# Altium schematic sheet 06_MCU.SchDoc
size OrCAD B
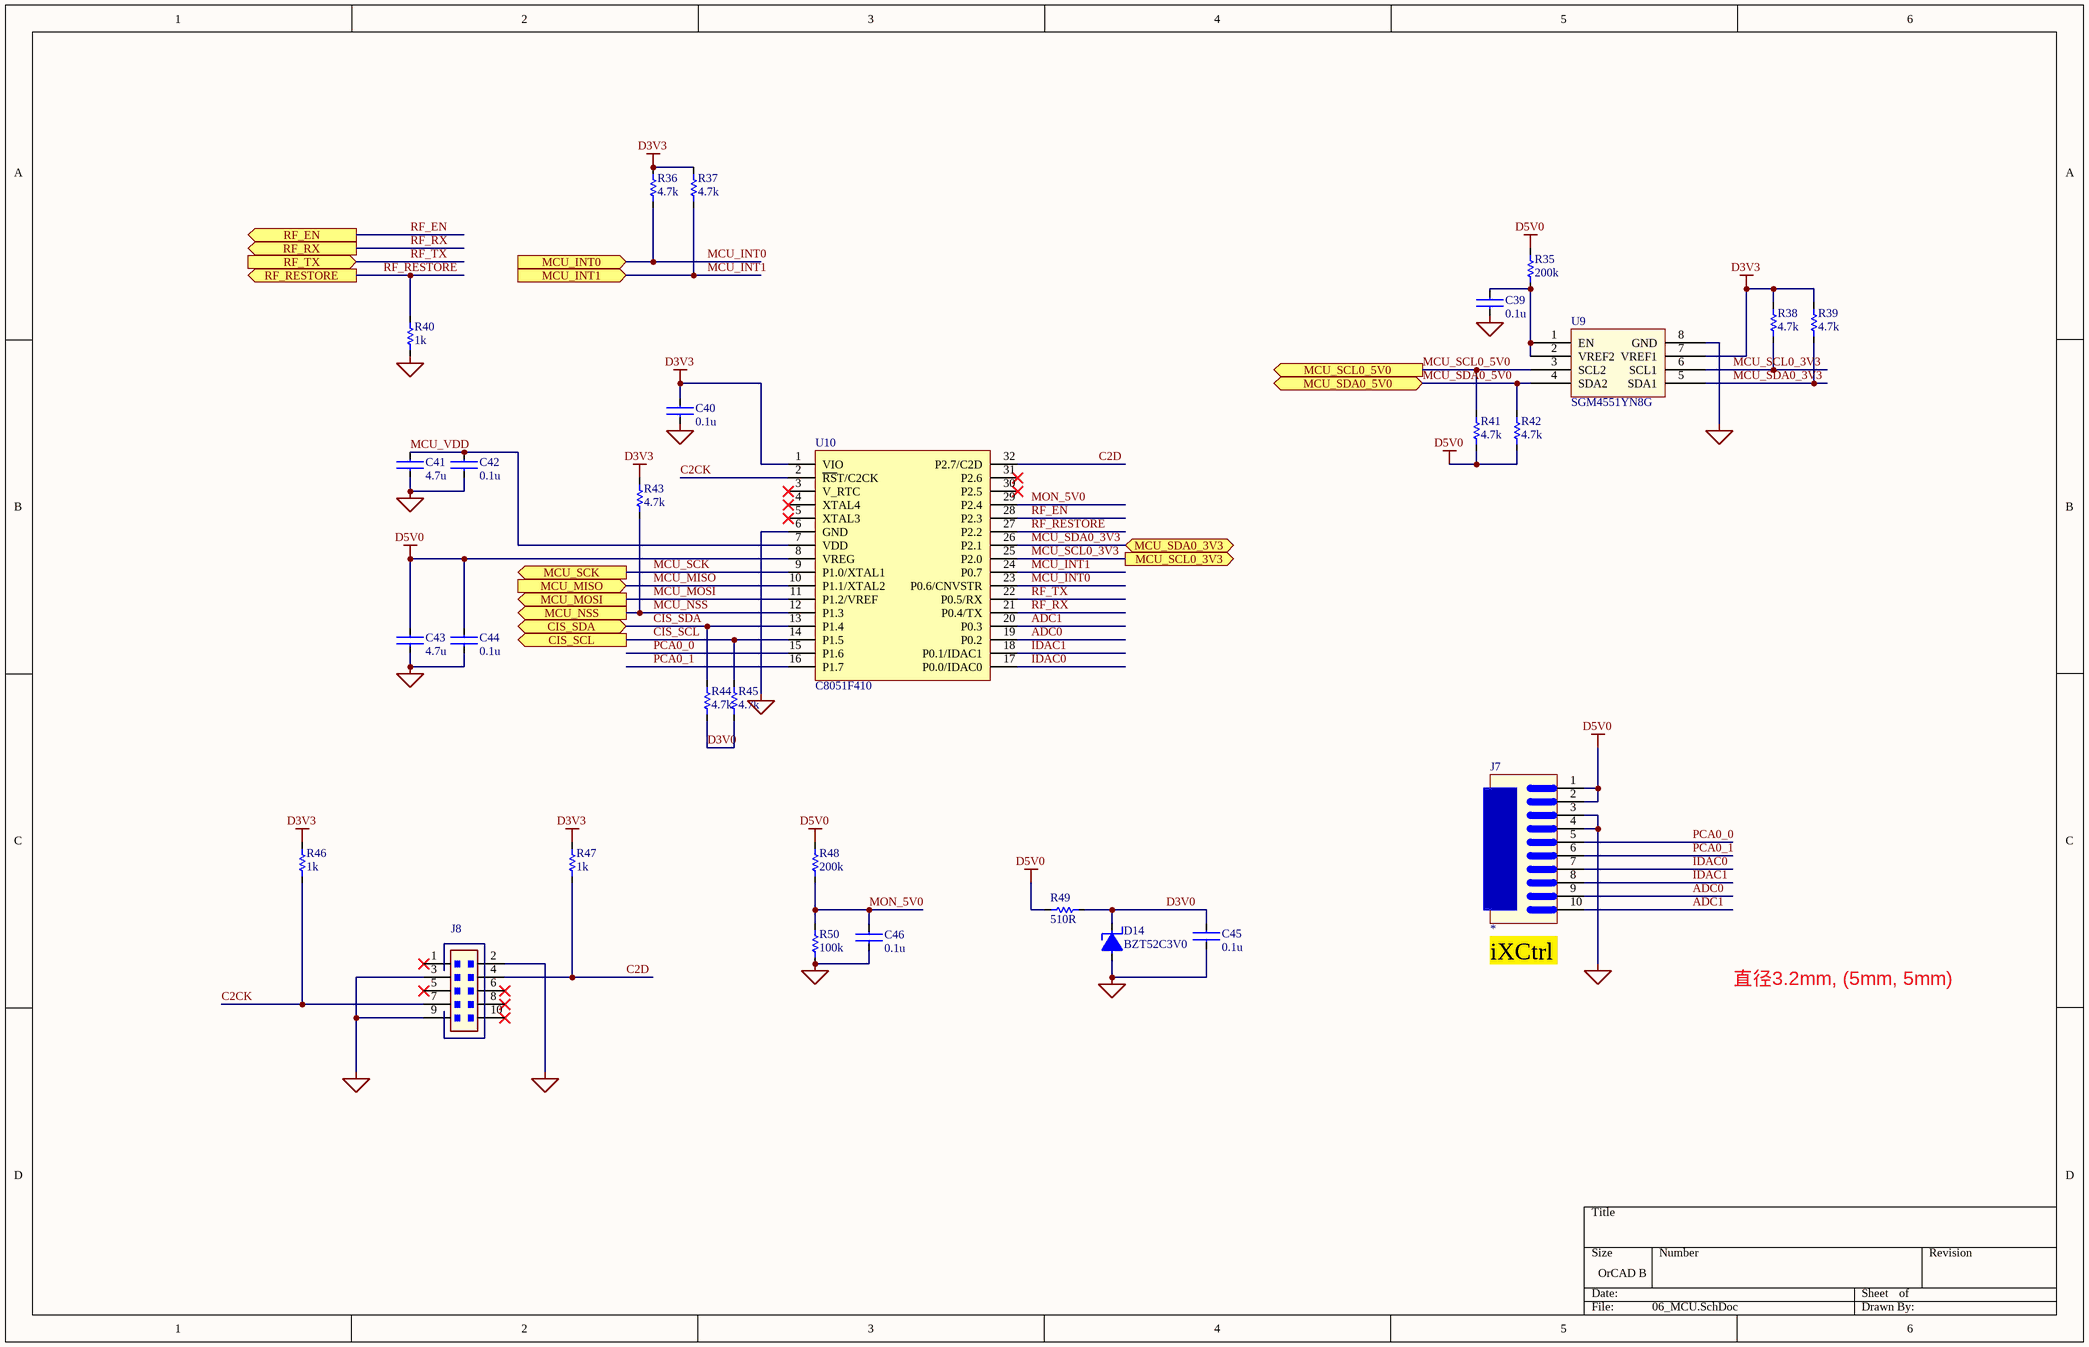
[diagram p0: 06_MCU.SchDoc]

## Parts
C39  0.1u  [C0402]
C40  0.1u  [C0402]
C41  4.7u  [CAPC1608X09N_C0603]
C42  0.1u  [C0402]
C43  4.7u  [CAPC1608X09N_C0603]
C44  0.1u  [C0402]
C45  0.1u  [C0402]
C46  0.1u  [C0402]
D14  BZT52C3V0  [SODFL370X10-2N_SOD123_BZT52C]
J7  *  [FPC0.5mm-10pin]
J8  JTAG  [3011001XXX00]  (value not drawn)
R35  200k  [R0402]
R36  4.7k  [R0402]
R37  4.7k  [R0402]
R38  4.7k  [R0402]
R39  4.7k  [R0402]
R40  1k  [R0402]
R41  4.7k  [R0402]
R42  4.7k  [R0402]
R43  4.7k  [R0402]
R44  4.7k  [R0402]
R45  4.7k  [R0402]
R46  1k  [R0402]
R47  1k  [R0402]
R48  200k  [R0402]
R49  510R  [R0402]
R50  100k  [R0402]
U9  SGM4551YN8G  [TSOP65P280X125-8N_SGM4551]
U10  C8051F410  [TQFP80P900X900X160-32N]

## Ports
CIS_SCL (out), CIS_SDA (bidir), MCU_INT0 (in), MCU_INT1 (in), MCU_MISO (in), MCU_MOSI (out), MCU_NSS (out), MCU_SCK (out), MCU_SCL0_3V3 (out), MCU_SCL0_5V0 (out), MCU_SDA0_3V3 (bidir), MCU_SDA0_5V0 (bidir), RF_EN (out), RF_RESTORE (out), RF_RX (out), RF_TX (in)

## Nets
D3V3: C40.1 R36.2 R37.2 R38.2 R39.2 R43.2 R46.2 R47.2 U9.7(VREF1) U10.1(VIO)
D5V0: C43.1 C44.1 J7.1 J7.2 R35.2 R41.1 R42.1 R48.2 R49.1 U10.8(VREG)
GND: C39.2 C40.2 C41.2 C42.2 C43.2 C44.2 C45.2 C46.2 D14.1(A) J7.3 J7.4 J8.2 J8.3 J8.9 R40.1 R50.1 U9.8(GND) U10.6(GND)
ADC0: J7.9 U10.19(P0.2)
ADC1: J7.10 U10.20(P0.3)
C2CK: J8.7 R46.1 U10.2(~{RS}T/C2CK)
C2D: J8.4 R47.1 U10.32(P2.7/C2D)
CIS_SCL: R45.2 U10.14(P1.5) ; port CIS_SCL
CIS_SDA: R44.2 U10.13(P1.4) ; port CIS_SDA
D3V0: C45.1 D14.2(K) R44.1 R45.1 R49.2
IDAC0: J7.7 U10.17(P0.0/IDAC0)
IDAC1: J7.8 U10.18(P0.1/IDAC1)
MCU_INT0: R36.1 U10.23(P0.6/CNVSTR) ; port MCU_INT0
MCU_INT1: R37.1 U10.24(P0.7) ; port MCU_INT1
MCU_MISO: U10.10(P1.1/XTAL2) ; port MCU_MISO
MCU_MOSI: U10.11(P1.2/VREF) ; port MCU_MOSI
MCU_NSS: R43.1 U10.12(P1.3) ; port MCU_NSS
MCU_SCK: U10.9(P1.0/XTAL1) ; port MCU_SCK
MCU_SCL0_3V3: R38.1 U9.6(SCL1) U10.25(P2.0) ; port MCU_SCL0_3V3
MCU_SCL0_5V0: R41.2 U9.3(SCL2) ; port MCU_SCL0_5V0
MCU_SDA0_3V3: R39.1 U9.5(SDA1) U10.26(P2.1) ; port MCU_SDA0_3V3
MCU_SDA0_5V0: R42.2 U9.4(SDA2) ; port MCU_SDA0_5V0
MCU_VDD: C41.1 C42.1 U10.7(VDD)
MON_5V0: C46.1 R48.1 R50.2 U10.29(P2.4)
PCA0_0: J7.5 U10.15(P1.6)
PCA0_1: J7.6 U10.16(P1.7)
RF_EN: U10.28(P2.3) ; port RF_EN
RF_RESTORE: R40.2 U10.27(P2.2) ; port RF_RESTORE
RF_RX: U10.21(P0.4/TX) ; port RF_RX
RF_TX: U10.22(P0.5/RX) ; port RF_TX
NetC39_1: C39.1 R35.1 U9.1(EN) U9.2(VREF2)

Not connected (* = marked no-connect by the designer): J8 1(0)* 5(4)* 6(5)* 8* 10(9)*; U10 3(V_RTC)* 4(XTAL4)* 5(XTAL3)* 30(P2.5)* 31(P2.6)*

## Notes on the sheet
- (near J7) iXCtrl
- 直径3.2mm, (5mm, 5mm)

## Library data of the parts
C39 C40 C42 C44-C46 = CAP011: CAP,Ceramic,X7R,10%,16V,0.1uF,0402; Manufacturer1: *; Manufacturer2: *; PartNumberManufacturer1: *; UnitPrice: *; Value: 0.1u
C41 C43 = CAP17: CAP,Ceramic,X5R,10%,6.3V,4.7uF,0603; Manufacturer1: *; Manufacturer2: *; PartNumberManufacturer1: *; UnitPrice: *; Value: 4.7u
D14 = BZT52C3V0: Zener Diodes,3.0V,5mA,2%,SOD123; Manufacturer1: DIODES; Manufacturer2: *; PartNumberManufacturer1: BZT52C3V0; PartNumberManufacturer2: *; UnitPrice: *
J7 = FPC0.5mm_06: FFC socket,10-Pin,bottom contact,0.5mm Pitch,SMD; Manufacturer1: *; Manufacturer2: *; PartNumberManufacturer1: *; PartNumberManufacturer2: *; UnitPrice: *
J8 = 3011001XXX00: Header,10Pin,Vertical,2.54mm Pitch,TH; Manufacturer1: *; Manufacturer2: *; PartNumberManufacturer1: *; PartNumberManufacturer2: *; UnitPrice: *
R35 R48 = RES0117: RES,200k,1%,1/16W,0402; Manufacturer1: *; PartNumberManufacturer2: *; Manufacturer2: *; PartNumberManufacturer1: *; Value: 200k; UnitPrice: *
R36-R39 R41-R45 = RES015: RES,4.7k,1%,1/16W,0402; Manufacturer1: *; PartNumberManufacturer2: *; Manufacturer2: *; PartNumberManufacturer1: *; Value: 4.7k; UnitPrice: *
R40 R46 R47 = RES011: RES,1k,1%,1/16W,0402; PartNumberManufacturer2: *; Manufacturer2: *; PartNumberManufacturer1: *; UnitPrice: *; Manufacturer1: *; Value: 1k
R49 = RES0128: RES,510R,1%,1/16W,0402; PartNumberManufacturer2: *; Manufacturer2: *; PartNumberManufacturer1: *; UnitPrice: *; Manufacturer1: *; Value: 510R
R50 = RES013: RES,100k,1%,1/16W,0402; Manufacturer1: *; PartNumberManufacturer2: *; Manufacturer2: *; PartNumberManufacturer1: *; Value: 100k; UnitPrice: *
U9 = SGM4551YN8G: IC,I2C-bus and SMBus voltage-level translator,SOT23-8; Manufacturer1: SGM; PartNumberManufacturer1: SGM4551YN8G; Manufacturer2: *; PartNumberManufacturer2: *; UnitPrice: *
U10 = C8051F410: IC,MCU,50MIPS,32K FLASH,12bits ADC,TQFP32; Manufacturer1: Silicon Labs; Manufacturer2: *; PartNumberManufacturer1: C8051F410; PartNumberManufacturer2: *